# EAGLE schematic oh-tannenbaum (EAGLE 6.5.0)
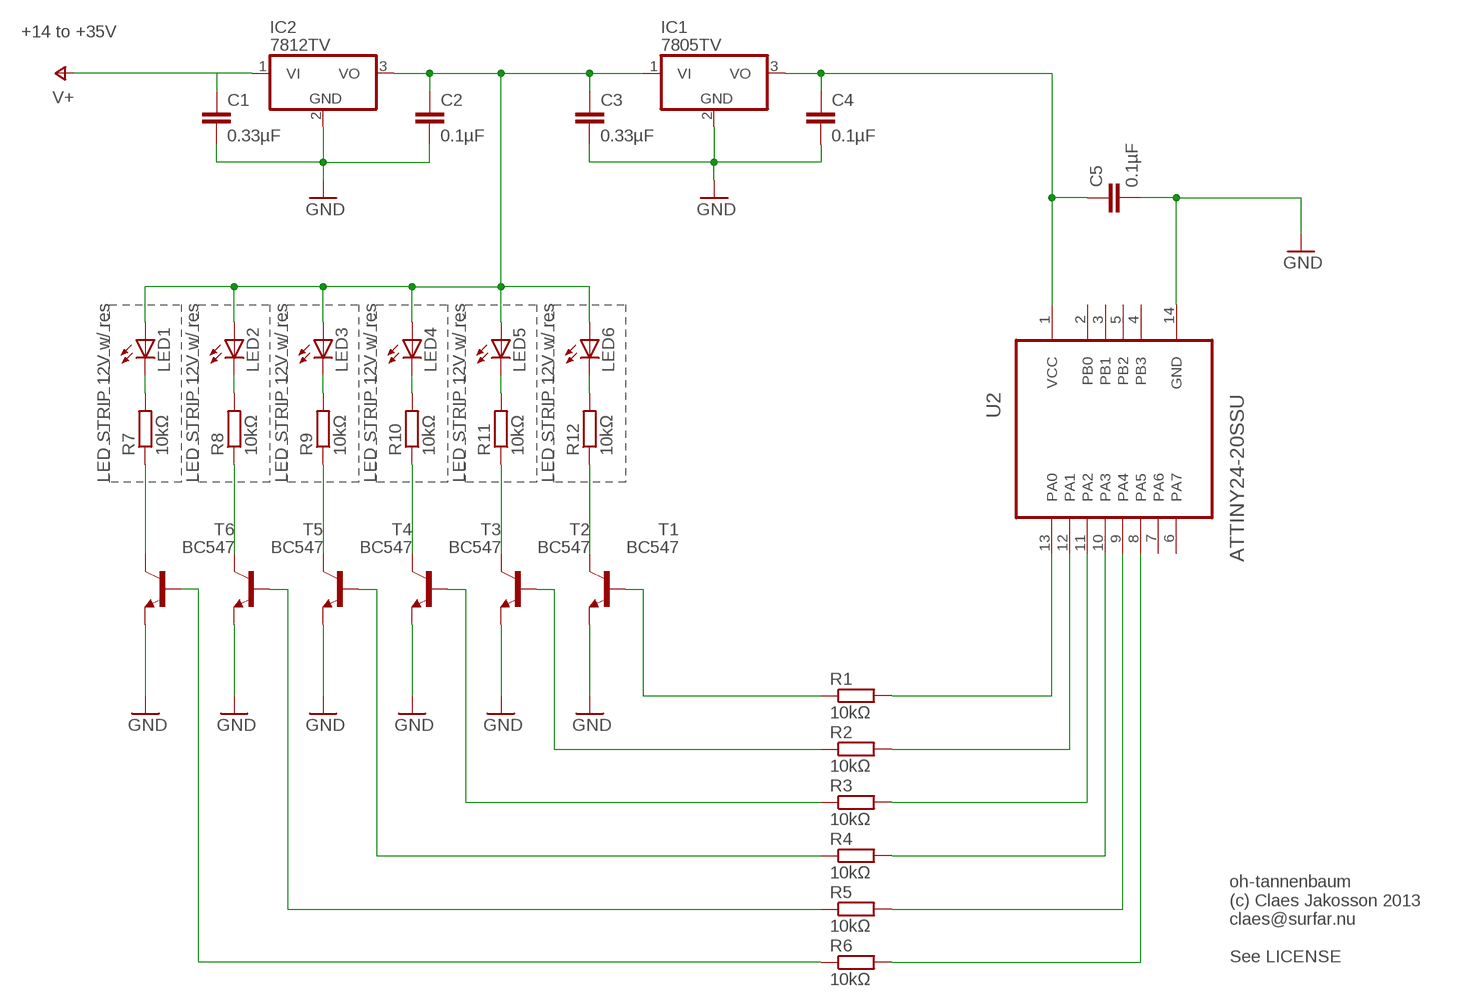
[diagram p0: schematic, sheet 1]

## Parts
C1  0.33µF  C-EU025-050X050  [C025-050X050]
C2  0.1µF  C-EU025-050X050  [C025-050X050]
C3  0.33µF  C-EU025-050X050  [C025-050X050]
C4  0.1µF  C-EU025-050X050  [C025-050X050]
C5  0.1µF  C-EU025-050X050  [C025-050X050]
IC1  7805TV  [TO220V]
IC2  7812TV  [TO220V]
LED1  LEDCHIPLED_0805  [CHIPLED_0805]
LED2  LEDCHIPLED_0805  [CHIPLED_0805]
LED3  LEDCHIPLED_0805  [CHIPLED_0805]
LED4  LEDCHIPLED_0805  [CHIPLED_0805]
LED5  LEDCHIPLED_0805  [CHIPLED_0805]
LED6  LEDCHIPLED_0805  [CHIPLED_0805]
R1  10kΩ  R-EU_0204/7  [0204/7]
R2  10kΩ  R-EU_0204/7  [0204/7]
R3  10kΩ  R-EU_0204/7  [0204/7]
R4  10kΩ  R-EU_0204/7  [0204/7]
R5  10kΩ  R-EU_0204/7  [0204/7]
R6  10kΩ  R-EU_0204/7  [0204/7]
R7  10kΩ  R-EU_0204/7  [0204/7]
R8  10kΩ  R-EU_0204/7  [0204/7]
R9  10kΩ  R-EU_0204/7  [0204/7]
R10  10kΩ  R-EU_0204/7  [0204/7]
R11  10kΩ  R-EU_0204/7  [0204/7]
R12  10kΩ  R-EU_0204/7  [0204/7]
T1  BC547  [TO92]
T2  BC547  [TO92]
T3  BC547  [TO92]
T4  BC547  [TO92]
T5  BC547  [TO92]
T6  BC547  [TO92]
U2  ATTINY24-20SSU  [SOIC127P600X175-14N]

## Nets
GND: C1.2 C2.2 C3.2 C4.2 C5.2 IC1.2(GND) IC2.2(GND) T1.1(E) T2.1(E) T3.1(E) T4.1(E) T5.1(E) T6.1(E) U2.14(GND)
N$1: R6.1 T6.2(B)
N$2: R5.1 T5.2(B)
N$3: R4.1 T4.2(B)
N$4: R3.1 T3.2(B)
N$5: R2.1 T2.2(B)
N$6: R1.1 T1.2(B)
N$7: R1.2 U2.13(PA0)
N$8: R2.2 U2.12(PA1)
N$9: R3.2 U2.11(PA2)
N$10: R4.2 U2.10(PA3)
N$11: R5.2 U2.9(PA4)
N$12: R6.2 U2.8(PA5)
N$14: LED1.C R7.2
N$15: C2.1 C3.1 IC1.1(VI) IC2.3(VO) LED2.A LED3.A LED4.A LED5.A LED6.A
N$16: R7.1 T6.3(C)
N$17: C4.1 C5.1 IC1.3(VO) U2.1(VCC)
N$18: LED1.A
N$19: LED2.C R8.2
N$20: R8.1 T5.3(C)
N$22: LED3.C R9.2
N$23: R9.1 T4.3(C)
N$25: LED4.C R10.2
N$26: R10.1 T3.3(C)
N$28: LED5.C R11.2
N$29: R11.1 T2.3(C)
N$31: LED6.C R12.2
N$32: R12.1 T1.3(C)
V+: C1.1 IC2.1(VI)
Unconnected: U2.2(PB0) U2.3(PB1) U2.4(PB3) U2.5(PB2) U2.6(PA7) U2.7(PA6)

## Notes on the sheet
- +14 to +35V
- LED STRIP 12V w/ res | LED STRIP 12V w/ res | LED STRIP 12V w/ res | LED STRIP 12V w/ res | LED STRIP 12V w/ res | LED STRIP 12V w/ res
- oh-tannenbaum
  (c) Claes Jakosson 2013
  claes@surfar.nu
  
  See LICENSE

## Library data of the parts
C1-C5 = resistor:C-EU: CAPACITOR, European symbol
IC1 IC2 = linear:78*: Positive VOLTAGE REGULATOR Source: http://cache.national.com/ds/LM/LM78L05.pdf http://www.fairchildsemi.com/ds/LM/LM7805.pdf
LED1-LED6 = led:LED: LED OSRAM: - CHIPLED LG R971, LG N971, LY N971, LG Q971, LY Q971, LO R971, LY R971 LH N974, LH R974 LS Q976, LO Q976, LY Q976 LO Q996 - Hyper CHIPLED LW Q18S LB Q993, LB Q99A, LB R99A - SideLED LS A670, LO A670, LY A670, LG A670, LP A670 LB A673, LV A673, LT A673, LW A673 LH A674 LY A675 LS A676, LA A676, LO A676, LY A676, LW A676 LS A679, LY A679, LG A679 - Hyper Micro SIDELED® LS Y876, LA Y876, LO Y876, LY Y876 LT Y87S - SmartLED LW L88C, LW L88S LB L89C, LB L89S, LG L890 LS L89K, LO L89K, LY L89K LS L896, LA L896, LO L896, LY L896 - TOPLED LS T670, LO T670, LY T670, LG T670, LP T670 LSG T670, LSP T670, LSY T670, LOP T670, LYG T670 LG T671, LOG T671, LSG T671 LB T673, LV T673, LT T673, LW T673 LH T674 LS T676, LA T676, LO T676, LY T676, LB T676, LH T676, LSB T676, LW T676 LB T67C, LV T67C, LT T67C, LS T67K, LO T67K, LY T67K, LW E67C LS E67B, LA E67B, LO E67B, LY E67B, LB E67C, LV E67C, LT E67C LW T67C LS T679, LY T679, LG T679 LS T770, LO T770, LY T770, LG T770, LP T770 LB T773, LV T773, LT T773, LW T773 LH T774 LS E675, LA E675, LY E675, LS T675 LS T776, LA T776, LO T776, LY T776, LB T776 LHGB T686 LT T68C, LB T68C - Hyper Mini TOPLED® LB M676 - Mini TOPLED Santana® LG M470 LS M47K, LO M47K, LY M47K Source: http://www.osram.convergy.de LUXEON: - LUMILED® LXK2-PW12-R00, LXK2-PW12-S00, LXK2-PW14-U00, LXK2-PW14-V00 LXK2-PM12-R00, LXK2-PM12-S00, LXK2-PM14-U00 LXK2-PE12-Q00, LXK2-PE12-R00, LXK2-PE12-S00, LXK2-PE14-T00, LXK2-PE14-U00 LXK2-PB12-K00, LXK2-PB12-L00, LXK2-PB12-M00, LXK2-PB14-N00, LXK2-PB14-P00, LXK2-PB14-Q00 LXK2-PR12-L00, LXK2-PR12-M00, LXK2-PR14-Q00, LXK2-PR14-R00 LXK2-PD12-Q00, LXK2-PD12-R00, LXK2-PD12-S00 LXK2-PH12-R00, LXK2-PH12-S00 LXK2-PL12-P00, LXK2-PL12-Q00, LXK2-PL12-R00 Source: www.luxeon.com KINGBRIGHT: KA-3528ASYC Source: www.kingbright.com
R1-R12 = resistor:R-EU_: RESISTOR, European symbol
T1-T6 = transistor:BC547: NPN TRANSISTOR
U2 = Atmel-ATTINY24-20SSU:ATTINY24-20SSU: 8-bit Microcontroller with Bytes In-System Programmable Flash; MPN: ATTINY24-20SSU; OC_FARNELL: 1455137; OC_NEWARK: 58M3775; PACKAGE: SOIC-14; SUPPLIER: Atmel